# EAGLE design RotaryPCB (EAGLE 9.7.0)
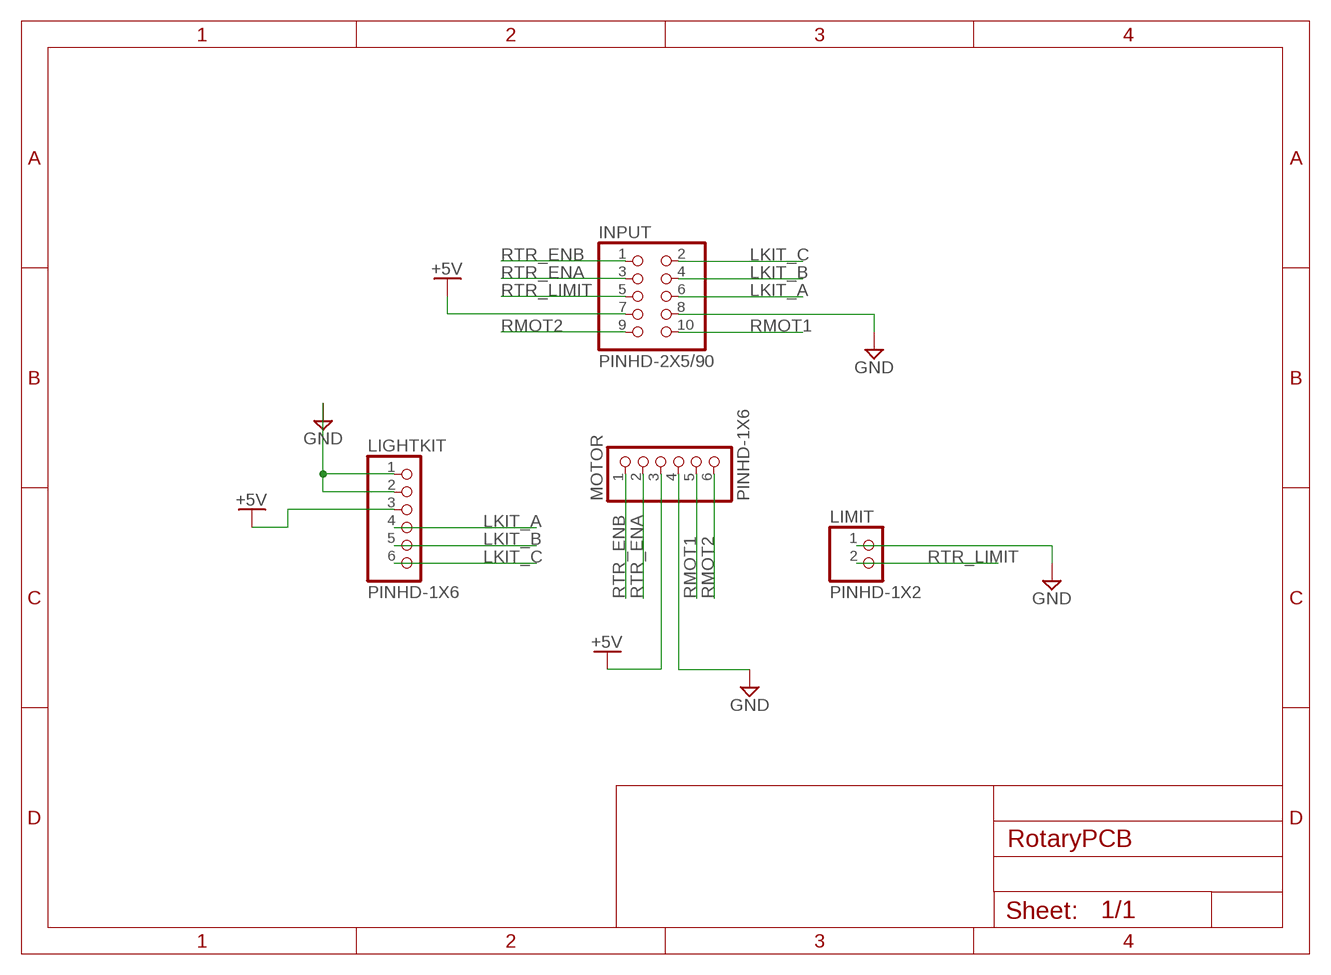
[diagram p0: schematic, sheet 1]

## Parts
INPUT  PINHD-2X5/90  [2X05/90]
LIGHTKIT  PINHD-1X6  [1X06]
LIMIT  PINHD-1X2  [1X02]
MOTOR  PINHD-1X6  [1X06]

## Nets
+5V [5VPower]: INPUT.7 LIGHTKIT.3 MOTOR.3
GND [5VPower]: INPUT.8 LIGHTKIT.1 LIGHTKIT.2 LIMIT.1 MOTOR.4
LKIT_A: INPUT.6 LIGHTKIT.4
LKIT_B: INPUT.4 LIGHTKIT.5
LKIT_C: INPUT.2 LIGHTKIT.6
RMOT1 [Motor Power]: INPUT.10 MOTOR.5
RMOT2 [Motor Power]: INPUT.9 MOTOR.6
RTR_ENA: INPUT.3 MOTOR.2
RTR_ENB: INPUT.1 MOTOR.1
RTR_LIMIT: INPUT.5 LIMIT.2

## Library data of the parts
INPUT = Connector:PINHD-2X5: PIN HEADER; CATEGORY: CONNECTOR; SUB-CATEGORY: PIN-HEADER
LIGHTKIT MOTOR = Connector:PINHD-1X6: PIN HEADER; CATEGORY: CONNECTOR; SUB-CATEGORY: PIN-HEADER
LIMIT = Connector:PINHD-1X2: PIN HEADER; CATEGORY: CONNECTOR; SUB-CATEGORY: PIN-HEADER

## Net classes
1 Motor Power: width 0.61 mm
2 5VPower: width 0.406 mm

## Board
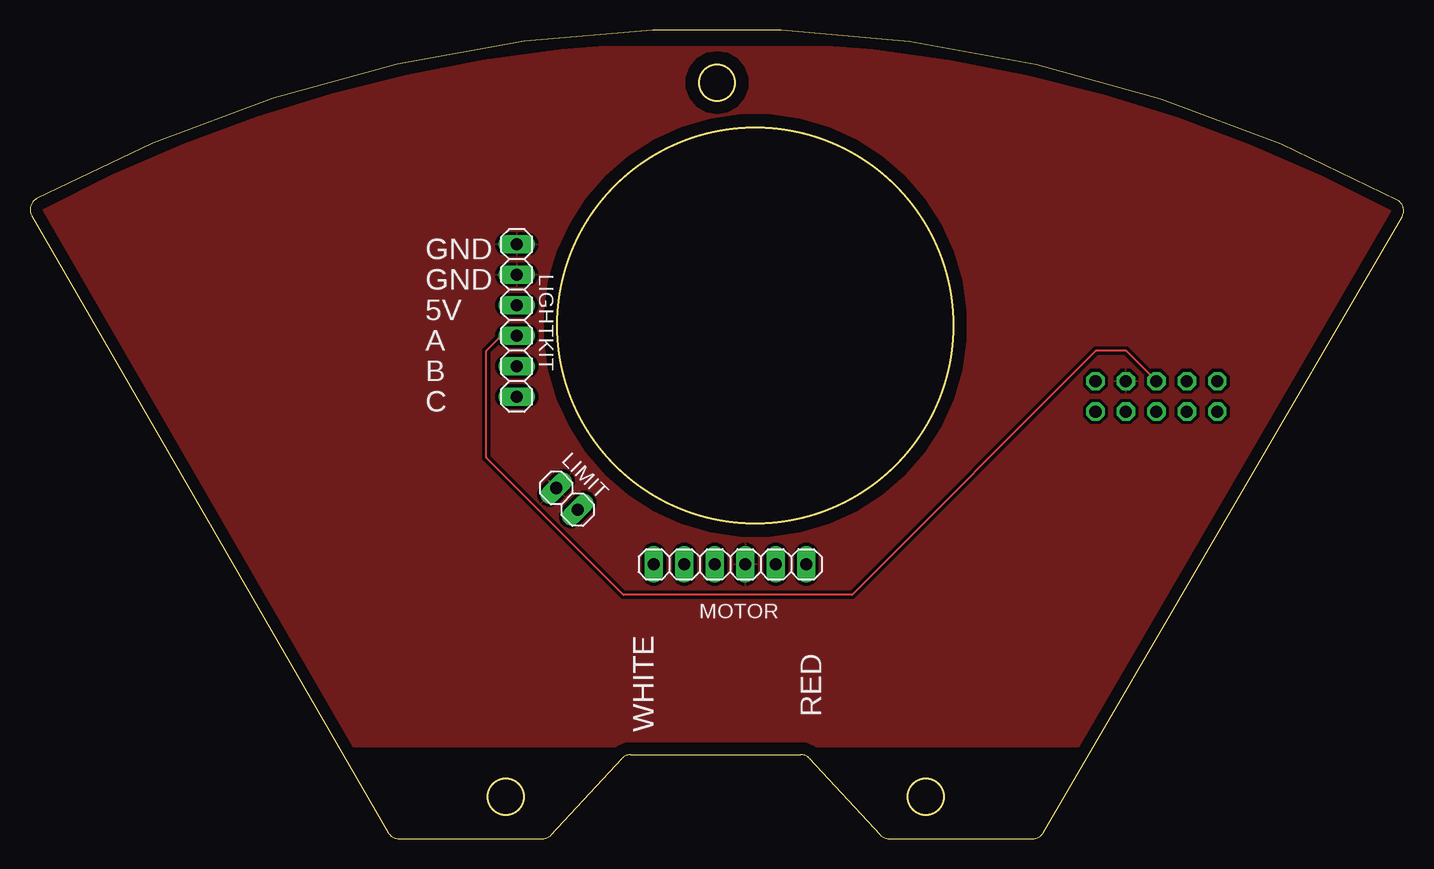
[diagram p1: board, top side]
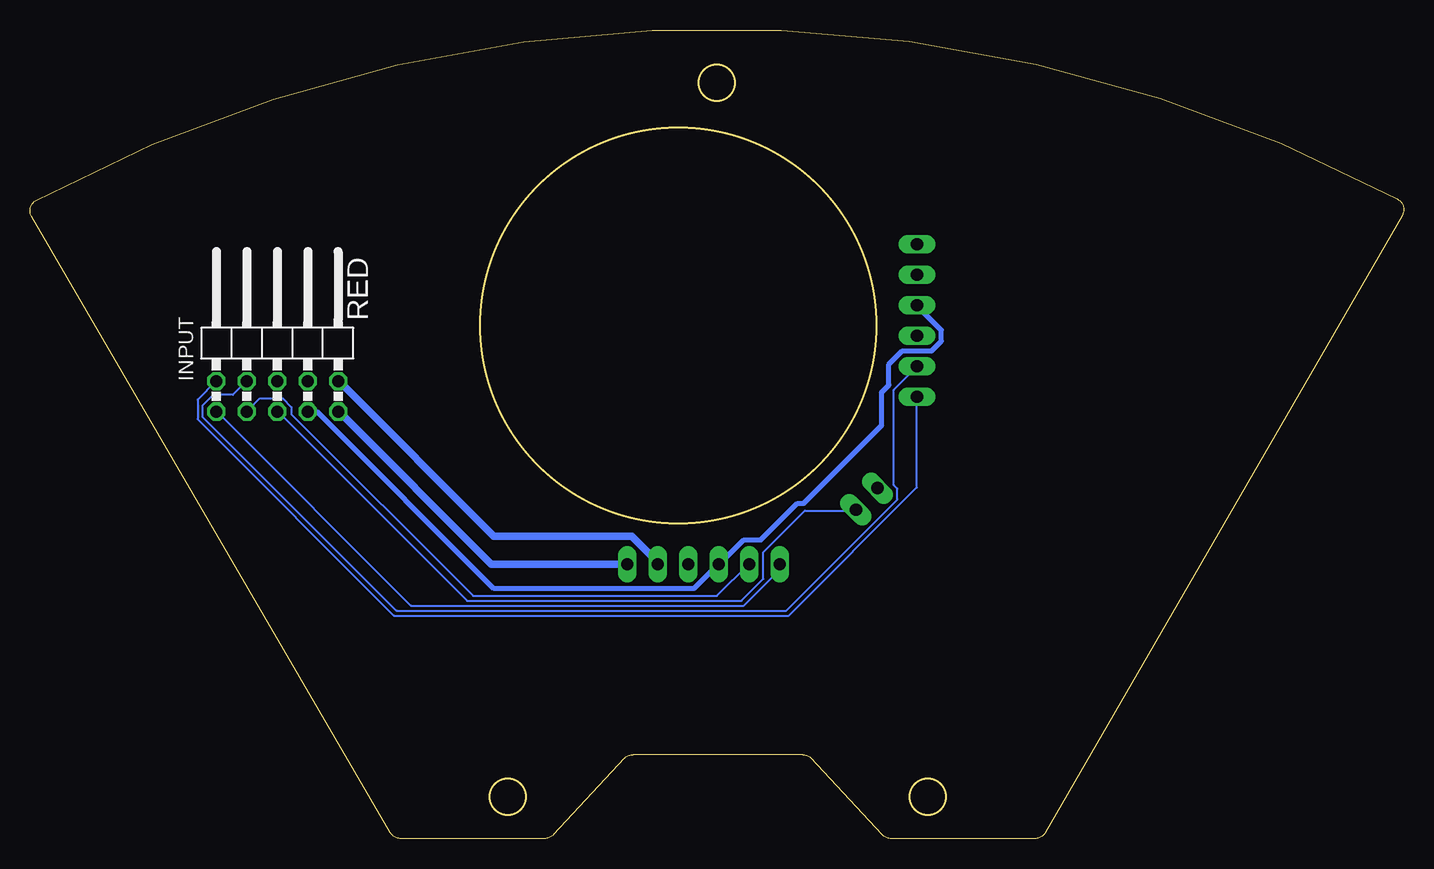
[diagram p2: board, bottom side, seen from below]

Size 114.47 x 67.38 mm. Coordinates in mm from the lower left corner, seen from the top.
Outline: 64.94,6.68 70.85,0.32 arc47 71.58,0 83.57,0 arc60 84.44,0.5 114.34,51.82 arc92 113.95,53.2 arc56 0.53,53.3 arc92 0.13,51.92 29.86,0.5 arc60 30.72,0 42.71,0 arc47 43.44,0.32 49.35,6.68 arc-47 50.08,7 64.21,7 arc-47 64.94,6.68
Outline: circle at 74.65,3.5 radius 1.5
Outline: circle at 57.25,63 radius 1.5
Outline: circle at 39.65,3.5 radius 1.5
Outline: circle at 60.44,42.76 radius 16.5
Copper layers (1*16): Top 0.035mm / dielectric 1.5mm / Bottom 0.035mm
Design rules "default *": minimum track width 6mil, minimum drill 0.35mm, track to track 10mil, track to pad 10mil, pad to pad 10mil, via to via 10mil, smd to smd 6mil, copper to edge 40mil, drill to drill 6mil, minimum pad ring 10mil, minimum via ring 8mil, stop-mask expansion 4mil, vias tented up to drill 0mil, thermal gap 10mil

### Footprints (pad centres in the part's own frame; a part is rotated, then mirrored left to right if it is on the bottom)
2X05/90 = drill 1.016 octagon: 1 -5.08,-6.35; 2 -5.08,-3.81; 3 -2.54,-6.35; 4 -2.54,-3.81; 5 0,-6.35; 6 0,-3.81; 7 2.54,-6.35; 8 2.54,-3.81; 9 5.08,-6.35; 10 5.08,-3.81
1X06 = drill 1.016 long: 1 -6.35,0; 2 -3.81,0; 3 -1.27,0; 4 1.27,0; 5 3.81,0; 6 6.35,0
1X02 = drill 1.016 long: 1 -1.27,0; 2 1.27,0

### Placement (x,y rotation side)
INPUT  93.87,41.93 0 bottom
LIGHTKIT  40.56,43.18 270 top
LIMIT  44.74,28.31 315 top
MOTOR  58.34,22.86 0 top

### Tracks (layer width: path | path; a pad name or v marks a point on that pad's centre or on a via)
+5V
  Bottom 0.406: LIGHTKIT.3 40.56,44.4 38.53,42.37 38.53,41.45 39.34,40.64 41.78,40.64 42.9,39.52 42.9,37.8 43.51,37.19 43.51,34.44 50.01,27.94 50.52,27.94 53.57,24.89 54.99,24.89 57.02,22.86 MOTOR.3 57.22,22.76 59.15,20.83 75.82,20.83 90.55,35.56 91.26,35.56 INPUT.7
GND
  pour Top: -0.08,66.04 114.22,66.04 114.22,7.62 -0.08,7.62
LKIT_A
  Top 0.152: INPUT.6 93.87,38.14 91.36,40.64 88.82,40.64 68.5,20.32 49.45,20.32 38.02,31.75 38.02,40.64 39.29,41.91 LIGHTKIT.4
LKIT_B
  Bottom 0.152: LIGHTKIT.5 40.56,39.32 42.49,37.39 42.49,29.46 42.19,29.16 42.19,28.25 51.43,19 83.94,19 100.1,35.15 100.1,36.07 99.18,36.98 97.56,36.98 96.44,38.1 INPUT.4
LKIT_C
  Bottom 0.152: LIGHTKIT.6 40.56,29.26 51.23,18.59 84.15,18.59 100.51,34.95 100.51,36.58 98.98,38.1 INPUT.2
RMOT1
  Bottom 0.61: MOTOR.5 62.2,22.86 62.2,23.06 64.34,25.2 75.82,25.2 88.72,38.1 INPUT.10
RMOT2
  Bottom 0.61: MOTOR.6 76.02,22.86 88.72,35.56 INPUT.9
RTR_ENA
  Bottom 0.152: MOTOR.2 54.58,22.86 57.22,20.22 77.54,20.22 92.68,35.36 92.68,35.97 93.39,36.68 95.32,36.68 96.34,35.66 INPUT.3
RTR_ENB
  Bottom 0.152: MOTOR.1 52.04,22.86 52.04,22.35 54.99,19.41 82.73,19.41 98.88,35.56 INPUT.1
RTR_LIMIT
  Bottom 0.152: LIMIT.2 45.64,27.33 49.91,27.33 53.36,23.88 53.36,21.64 55.19,19.81 78.05,19.81 93.8,35.56 INPUT.5

### Text on the board
tNames: GND | GND | 5V | A | B | C | RED | WHITE
bNames: RED